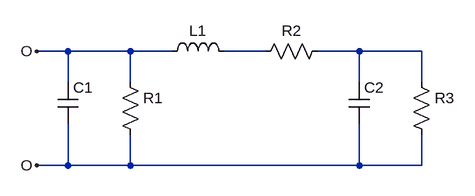
[diagram p0: schematic Circuito_2.asc]
Circuito_2.asc, the LTspice schematic file:
Version 4
SHEET 1 880 680
WIRE 32 96 -16 96
WIRE 128 96 32 96
WIRE 192 96 128 96
WIRE 336 96 272 96
WIRE 480 96 416 96
WIRE 576 96 480 96
WIRE 32 144 32 96
WIRE 128 144 128 96
WIRE 480 144 480 96
WIRE 576 144 576 96
WIRE 32 272 32 208
WIRE 32 272 -16 272
WIRE 128 272 128 224
WIRE 128 272 32 272
WIRE 480 272 480 208
WIRE 480 272 128 272
WIRE 576 272 576 224
WIRE 576 272 480 272
FLAG -16 96 O
FLAG -16 272 O
SYMBOL cap 16 144 R0
SYMATTR InstName C1
SYMATTR Value ""
SYMBOL res 112 128 R0
SYMATTR InstName R1
SYMATTR Value ""
SYMBOL ind 176 112 R270
WINDOW 0 32 56 VTop 2
WINDOW 3 5 56 VBottom 2
SYMATTR InstName L1
SYMATTR Value ""
SYMBOL res 320 112 R270
WINDOW 0 32 56 VTop 2
WINDOW 3 0 56 VBottom 2
SYMATTR InstName R2
SYMATTR Value ""
SYMBOL cap 464 144 R0
SYMATTR InstName C2
SYMATTR Value ""
SYMBOL res 560 128 R0
SYMATTR InstName R3
SYMATTR Value ""

The netlist it stands for:
* Circuito_2.asc
C1 O O
R1 O O
L1 O N001
R2 N001 N002
C2 N002 O
R3 N002 O
.backanno
.end